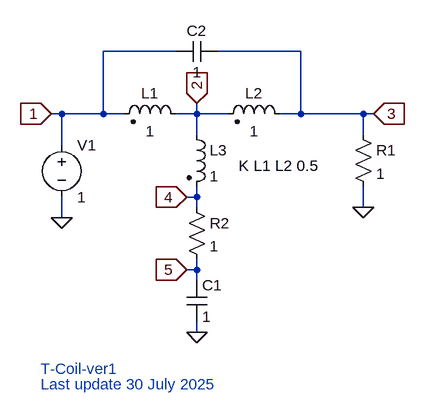
[diagram p0: schematic T-Coil-ver1.asc]
T-Coil-ver1.asc, the LTspice schematic file:
Version 4
SHEET 1 880 680
WIRE 320 -96 208 -96
WIRE 512 -96 384 -96
WIRE 144 0 128 0
WIRE 208 0 208 -96
WIRE 208 0 144 0
WIRE 240 0 208 0
WIRE 352 0 352 -16
WIRE 352 0 320 0
WIRE 400 0 352 0
WIRE 512 0 512 -96
WIRE 512 0 480 0
WIRE 608 0 512 0
WIRE 624 0 608 0
WIRE 352 32 352 0
WIRE 608 32 608 0
WIRE 144 48 144 0
WIRE 352 128 352 112
WIRE 352 128 336 128
WIRE 352 144 352 128
WIRE 608 144 608 112
WIRE 144 160 144 128
WIRE 352 240 352 224
WIRE 352 240 336 240
WIRE 352 256 352 240
WIRE 352 336 352 320
FLAG 144 160 0
FLAG 352 336 0
FLAG 608 144 0
FLAG 128 0 1
IOPIN 128 0 In
FLAG 352 -16 2
IOPIN 352 -16 In
FLAG 624 0 3
IOPIN 624 0 In
FLAG 336 128 4
IOPIN 336 128 In
FLAG 336 240 5
IOPIN 336 240 In
SYMBOL voltage 144 32 R0
SYMATTR InstName V1
SYMATTR Value 1
SYMBOL ind2 336 16 M270
WINDOW 0 32 56 VTop 2
WINDOW 3 5 56 VBottom 2
SYMATTR InstName L1
SYMATTR Value 1
SYMATTR Type ind
SYMBOL ind2 496 16 M270
WINDOW 0 32 56 VTop 2
WINDOW 3 5 56 VBottom 2
SYMATTR InstName L2
SYMATTR Value 1
SYMATTR Type ind
SYMBOL ind2 336 16 R0
SYMATTR InstName L3
SYMATTR Value 1
SYMATTR Type ind
SYMBOL cap 336 256 R0
SYMATTR InstName C1
SYMATTR Value 1
SYMBOL cap 384 -112 R90
WINDOW 0 0 32 VBottom 2
WINDOW 3 32 32 VTop 2
SYMATTR InstName C2
SYMATTR Value 1
SYMBOL res 592 16 R0
SYMATTR InstName R1
SYMATTR Value 1
SYMBOL res 336 128 R0
SYMATTR InstName R2
SYMATTR Value 1
TEXT 416 80 Left 2 !K L1 L2 0.5
TEXT 112 392 Left 2 ;T-Coil-ver1
TEXT 112 416 Left 2 ;Last update 30 July 2025

The netlist it stands for:
* T-Coil-ver1.asc
V1 1 0 1
L1 2 1 1
L2 3 2 1
L3 2 4 1
C1 5 0 1
C2 3 1 1
R1 3 0 1
R2 4 5 1
K L1 L2 0.5
* T-Coil-ver1
* Last update 30 July 2025
.backanno
.end